# EAGLE schematic bubbler (EAGLE 6.4)

## Sheet 1 of 4
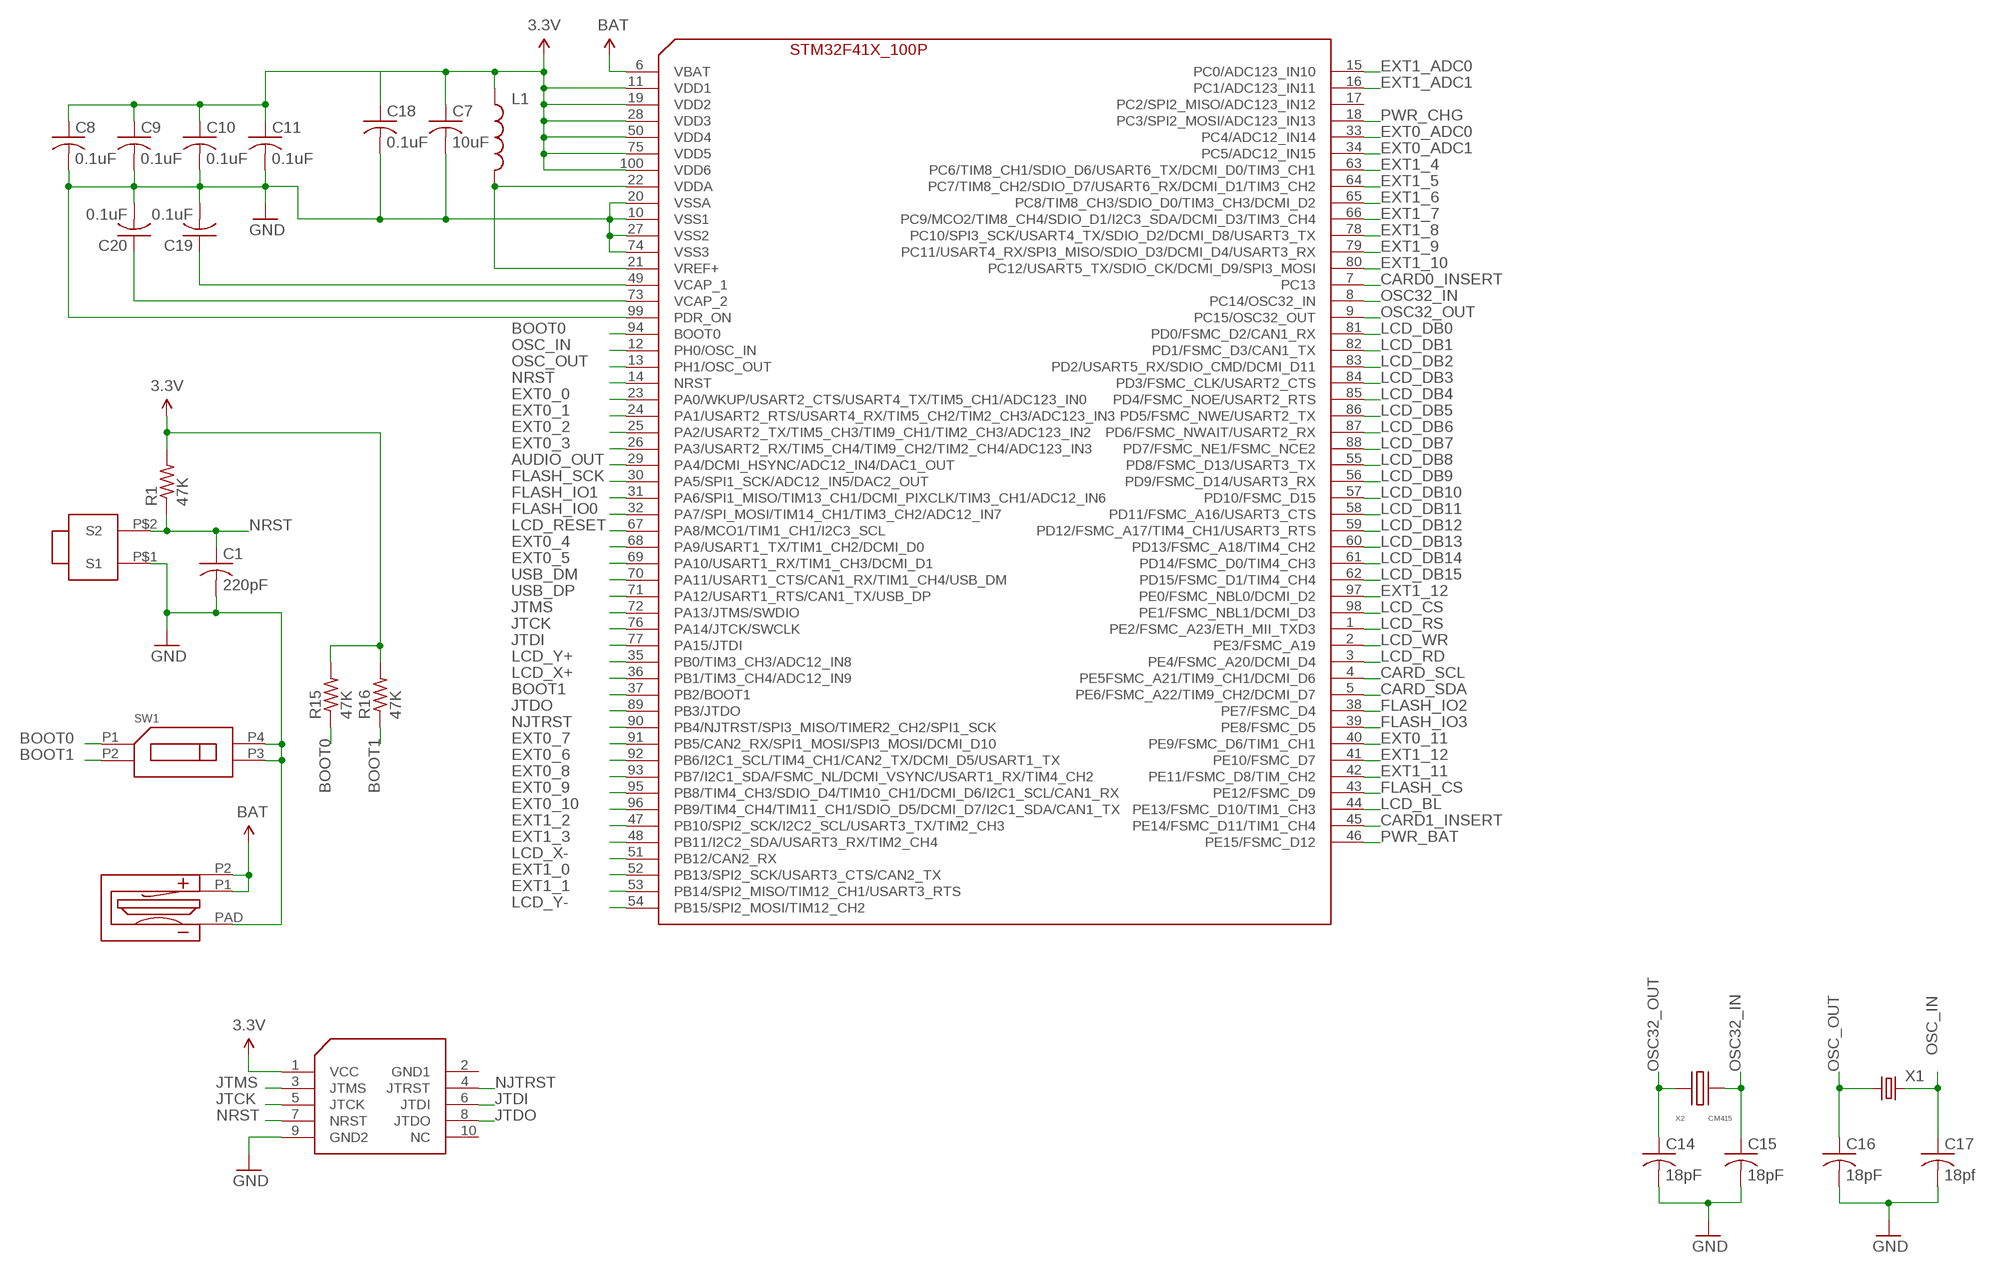
[diagram p0: schematic, sheet 1]

### Parts
B1  BATTERY-LINX-HLD-001  [BATTERY-LINX-HLD-001]
C1  220pF  C-USC0402  [C0402]
C7  10uF  C-USC0805  [C0805]
C8  0.1uF  C-USC0402  [C0402]
C9  0.1uF  C-USC0402  [C0402]
C10  0.1uF  C-USC0402  [C0402]
C11  0.1uF  C-USC0402  [C0402]
C14  18pF  C-USC0402  [C0402]
C15  18pF  C-USC0402  [C0402]
C16  18pF  C-USC0402  [C0402]
C17  18pf  C-USC0402  [C0402]
C18  0.1uF  C-USC0402  [C0402]
C19  0.1uF  C-USC0402  [C0402]
C20  0.1uF  C-USC0402  [C0402]
L1  INDUCTOR0603  [0603]
R1  47K  R-US_R0402  [R0402]
R15  47K  R-US_R0402  [R0402]
R16  47K  R-US_R0402  [R0402]
SW1  SWITCH-DIP-GDH-02  [SWITCH-DIP-GDH-02]
SW2  ITT-SWITCH-KSS-G  [ITT-KSS-G]
U1  STM32F41X-100P  [TQFP100]
U$1  STM32-JTAG-10P  [STM32-JTAG-10P]
X1  CRYSTAL5X3  [CRYSTAL-SMD-5X3]
X2  CM415  [CM415]

### Nets
3.3V: C7.1 C8.1 C9.1 C10.1 C11.1 C18.1 L1.1 R1.2 R15.2 R16.2 U1.11(VDD1) U1.19(VDD2) U1.28(VDD3) U1.50(VDD4) U1.75(VDD5) U1.100(VDD6) U$1.1(VCC) ; supply symbol labelled @3.3V ; also sheet 2,3,4
AUDIO_OUT: U1.29(PA4/DCMI_HSYNC/ADC12_IN4/DAC1_OUT) ; also sheet 4
BAT: B1.P1(BAT1) B1.P2(BAT2) U1.6(VBAT) ; supply symbol labelled @BAT
BOOT0: R15.1 SW1.P1(SW0_0) U1.94(BOOT0)
BOOT1: R16.1 SW1.P2(SW1_0) U1.37(PB2/BOOT1)
CARD0_INSERT: U1.7(PC13) ; also sheet 2
CARD1_INSERT: U1.45(PE14/FSMC_D11/TIM1_CH4) ; also sheet 2
CARD_SCL: U1.4(PE5FSMC_A21/TIM9_CH1/DCMI_D6) ; also sheet 2
CARD_SDA: U1.5(PE6/FSMC_A22/TIM9_CH2/DCMI_D7) ; also sheet 2
EXT0_0: U1.23(PA0/WKUP/USART2_CTS/USART4_TX/TIM5_CH1/ADC123_IN0) ; also sheet 2
EXT0_1: U1.24(PA1/USART2_RTS/USART4_RX/TIM5_CH2/TIM2_CH3/ADC123_IN3) ; also sheet 2
EXT0_2: U1.25(PA2/USART2_TX/TIM5_CH3/TIM9_CH1/TIM2_CH3/ADC123_IN2) ; also sheet 2
EXT0_3: U1.26(PA3/USART2_RX/TIM5_CH4/TIM9_CH2/TIM2_CH4/ADC123_IN3) ; also sheet 2
EXT0_4: U1.68(PA9/USART1_TX/TIM1_CH2/DCMI_D0) ; also sheet 2
EXT0_5: U1.69(PA10/USART1_RX/TIM1_CH3/DCMI_D1) ; also sheet 2
EXT0_6: U1.92(PB6/I2C1_SCL/TIM4_CH1/CAN2_TX/DCMI_D5/USART1_TX) ; also sheet 2
EXT0_7: U1.91(PB5/CAN2_RX/SPI1_MOSI/SPI3_MOSI/DCMI_D10) ; also sheet 2
EXT0_8: U1.93(PB7/I2C1_SDA/FSMC_NL/DCMI_VSYNC/USART1_RX/TIM4_CH2) ; also sheet 2
EXT0_9: U1.95(PB8/TIM4_CH3/SDIO_D4/TIM10_CH1/DCMI_D6/I2C1_SCL/CAN1_RX) ; also sheet 2
EXT0_10: U1.96(PB9/TIM4_CH4/TIM11_CH1/SDIO_D5/DCMI_D7/I2C1_SDA/CAN1_TX) ; also sheet 2
EXT0_11: U1.40(PE9/FSMC_D6/TIM1_CH1) ; also sheet 2
EXT0_ADC0: U1.33(PC4/ADC12_IN14) ; also sheet 2
EXT0_ADC1: U1.34(PC5/ADC12_IN15) ; also sheet 2
EXT1_0: U1.52(PB13/SPI2_SCK/USART3_CTS/CAN2_TX) ; also sheet 2
EXT1_1: U1.53(PB14/SPI2_MISO/TIM12_CH1/USART3_RTS) ; also sheet 2
EXT1_2: U1.47(PB10/SPI2_SCK/I2C2_SCL/USART3_TX/TIM2_CH3) ; also sheet 2
EXT1_3: U1.48(PB11/I2C2_SDA/USART3_RX/TIM2_CH4) ; also sheet 2
EXT1_4: U1.63(PC6/TIM8_CH1/SDIO_D6/USART6_TX/DCMI_D0/TIM3_CH1) ; also sheet 2
EXT1_5: U1.64(PC7/TIM8_CH2/SDIO_D7/USART6_RX/DCMI_D1/TIM3_CH2) ; also sheet 2
EXT1_6: U1.65(PC8/TIM8_CH3/SDIO_D0/TIM3_CH3/DCMI_D2) ; also sheet 2
EXT1_7: U1.66(PC9/MCO2/TIM8_CH4/SDIO_D1/I2C3_SDA/DCMI_D3/TIM3_CH4) ; also sheet 2
EXT1_8: U1.78(PC10/SPI3_SCK/USART4_TX/SDIO_D2/DCMI_D8/USART3_TX) ; also sheet 2
EXT1_9: U1.79(PC11/USART4_RX/SPI3_MISO/SDIO_D3/DCMI_D4/USART3_RX) ; also sheet 2
EXT1_10: U1.80(PC12/USART5_TX/SDIO_CK/DCMI_D9/SPI3_MOSI) ; also sheet 2
EXT1_11: U1.42(PE11/FSMC_D8/TIM_CH2) ; also sheet 2
EXT1_12: U1.41(PE10/FSMC_D7) U1.97(PE0/FSMC_NBL0/DCMI_D2) ; also sheet 2
EXT1_ADC0: U1.15(PC0/ADC123_IN10) ; also sheet 2
EXT1_ADC1: U1.16(PC1/ADC123_IN11) ; also sheet 2
FLASH_CS: U1.43(PE12/FSMC_D9) ; also sheet 4
FLASH_IO0: U1.32(PA7/SPI_MOSI/TIM14_CH1/TIM3_CH2/ADC12_IN7) ; also sheet 4
FLASH_IO1: U1.31(PA6/SPI1_MISO/TIM13_CH1/DCMI_PIXCLK/TIM3_CH1/ADC12_IN6) ; also sheet 4
FLASH_IO2: U1.38(PE7/FSMC_D4) ; also sheet 4
FLASH_IO3: U1.39(PE8/FSMC_D5) ; also sheet 4
FLASH_SCK: U1.30(PA5/SPI1_SCK/ADC12_IN5/DAC2_OUT) ; also sheet 4
GND: B1.PAD(GND) C1.2 C7.2 C8.2 C9.2 C10.2 C11.2 C14.2 C15.2 C16.2 C17.2 C18.2 C19.2 C20.2 SW1.P3(SW1_1) SW1.P4(SW0_1) SW2.P$1(S1) U1.10(VSS1) U1.20(VSSA) U1.27(VSS2) U1.74(VSS3) U1.99(PDR_ON) U$1.9(GND2) ; also sheet 2,3,4
JTCK: U1.76(PA14/JTCK/SWCLK) U$1.5(JTCK)
JTDI: U1.77(PA15/JTDI) U$1.6(JTDI)
JTDO: U1.89(PB3/JTDO) U$1.8(JTDO)
JTMS: U1.72(PA13/JTMS/SWDIO) U$1.3(JTMS)
LCD_BL: U1.44(PE13/FSMC_D10/TIM1_CH3) ; also sheet 3
LCD_CS: U1.98(PE1/FSMC_NBL1/DCMI_D3) ; also sheet 3
LCD_DB0: U1.81(PD0/FSMC_D2/CAN1_RX) ; also sheet 3
LCD_DB1: U1.82(PD1/FSMC_D3/CAN1_TX) ; also sheet 3
LCD_DB2: U1.83(PD2/USART5_RX/SDIO_CMD/DCMI_D11) ; also sheet 3
LCD_DB3: U1.84(PD3/FSMC_CLK/USART2_CTS) ; also sheet 3
LCD_DB4: U1.85(PD4/FSMC_NOE/USART2_RTS) ; also sheet 3
LCD_DB5: U1.86(PD5/FSMC_NWE/USART2_TX) ; also sheet 3
LCD_DB6: U1.87(PD6/FSMC_NWAIT/USART2_RX) ; also sheet 3
LCD_DB7: U1.88(PD7/FSMC_NE1/FSMC_NCE2) ; also sheet 3
LCD_DB8: U1.55(PD8/FSMC_D13/USART3_TX) ; also sheet 3
LCD_DB9: U1.56(PD9/FSMC_D14/USART3_RX) ; also sheet 3
LCD_DB10: U1.57(PD10/FSMC_D15) ; also sheet 3
LCD_DB11: U1.58(PD11/FSMC_A16/USART3_CTS) ; also sheet 3
LCD_DB12: U1.59(PD12/FSMC_A17/TIM4_CH1/USART3_RTS) ; also sheet 3
LCD_DB13: U1.60(PD13/FSMC_A18/TIM4_CH2) ; also sheet 3
LCD_DB14: U1.61(PD14/FSMC_D0/TIM4_CH3) ; also sheet 3
LCD_DB15: U1.62(PD15/FSMC_D1/TIM4_CH4) ; also sheet 3
LCD_RD: U1.3(PE4/FSMC_A20/DCMI_D4) ; also sheet 3
LCD_RESET: U1.67(PA8/MCO1/TIM1_CH1/I2C3_SCL) ; also sheet 3
LCD_RS: U1.1(PE2/FSMC_A23/ETH_MII_TXD3) ; also sheet 3
LCD_WR: U1.2(PE3/FSMC_A19) ; also sheet 3
LCD_X+: U1.36(PB1/TIM3_CH4/ADC12_IN9) ; also sheet 3
LCD_X-: U1.51(PB12/CAN2_RX) ; also sheet 3
LCD_Y+: U1.35(PB0/TIM3_CH3/ADC12_IN8) ; also sheet 3
LCD_Y-: U1.54(PB15/SPI2_MOSI/TIM12_CH2) ; also sheet 3
N$11: L1.2 U1.21(VREF+) U1.22(VDDA)
N$12: C19.1 U1.49(VCAP_1)
N$14: C20.1 U1.73(VCAP_2)
NJTRST: U1.90(PB4/NJTRST/SPI3_MISO/TIMER2_CH2/SPI1_SCK) U$1.4(JTRST)
NRST: C1.1 R1.1 SW2.P$2(S2) U1.14(NRST) U$1.7(NRST)
OSC32_IN: C15.1 U1.8(PC14/OSC32_IN) X2.P$2(XOUT)
OSC32_OUT: C14.1 U1.9(PC15/OSC32_OUT) X2.P$1(XIN)
OSC_IN: C17.1 U1.12(PH0/OSC_IN) X1.3
OSC_OUT: C16.1 U1.13(PH1/OSC_OUT) X1.1
PWR_BAT: U1.46(PE15/FSMC_D12) ; also sheet 2
PWR_CHG: U1.18(PC3/SPI2_MOSI/ADC123_IN13) ; also sheet 2
USB_DM: U1.70(PA11/USART1_CTS/CAN1_RX/TIM1_CH4/USB_DM) ; also sheet 2
USB_DP: U1.71(PA12/USART1_RTS/CAN1_TX/USB_DP) ; also sheet 2
Unconnected: U1.17(PC2/SPI2_MISO/ADC123_IN12) U$1.2(GND1) U$1.10(NC)

## Sheet 2 of 4
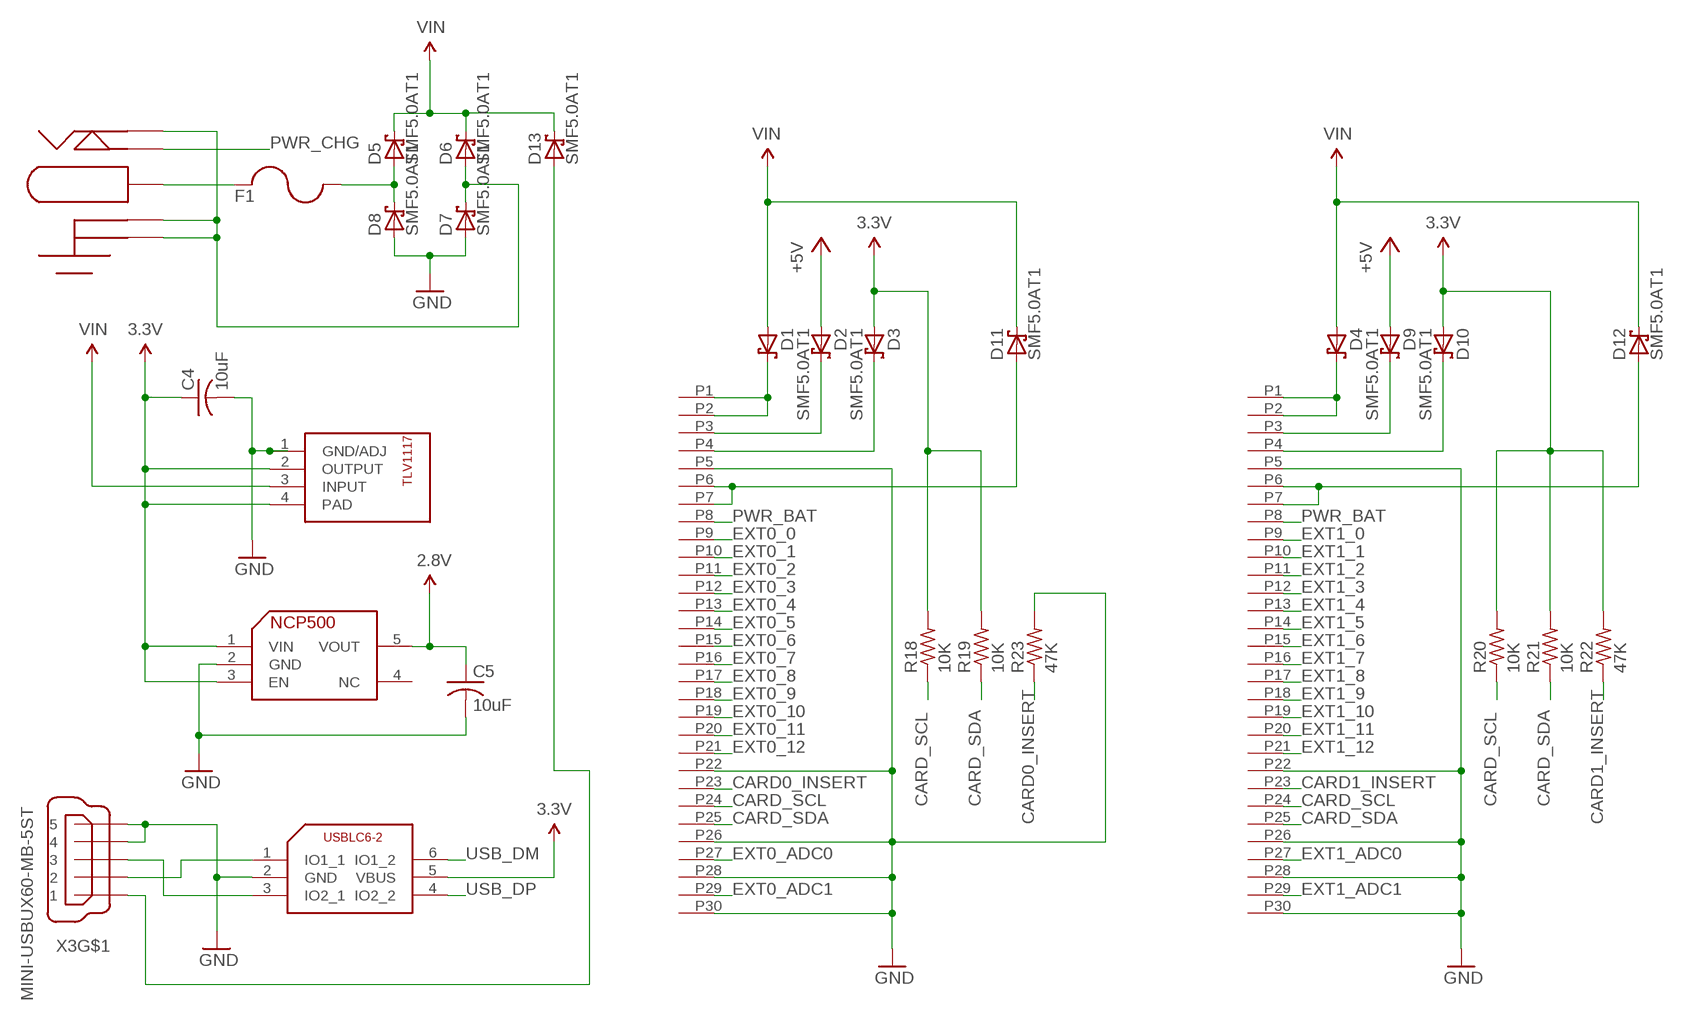
[diagram p1: schematic, sheet 2]

### Parts
C4  10uF  C-USC1206  [C1206]
C5  10uF  C-USC1206  [C1206]
CARD0  CONNECTOR-JAE-TX24-30F  [CONNECTOR-JAE-TX24-30]
CARD1  CONNECTOR-JAE-TX24-30F  [CONNECTOR-JAE-TX24-30]
D1  SCHOTTKY-DIODESMD  [SMB]
D2  SMF5.0AT1  [SOD123FL]
D3  SMF5.0AT1  [SOD123FL]
D4  SCHOTTKY-DIODESMD  [SMB]
D5  SMF5.0AT1  [SOD123FL]
D6  SMF5.0AT1  [SOD123FL]
D7  SMF5.0AT1  [SOD123FL]
D8  SMF5.0AT1  [SOD123FL]
D9  SMF5.0AT1  [SOD123FL]
D10  SMF5.0AT1  [SOD123FL]
D11  SMF5.0AT1  [SOD123FL]
D12  SMF5.0AT1  [SOD123FL]
D13  SMF5.0AT1  [SOD123FL]
F1  BOURNES-PTC-MF-SMXXXMF-SM030  [MF-SM030]
R18  10K  R-US_R0402  [R0402]
R19  10K  R-US_R0402  [R0402]
R20  10K  R-US_R0402  [R0402]
R21  10K  R-US_R0402  [R0402]
R22  47K  R-US_R0402  [R0402]
R23  47K  R-US_R0402  [R0402]
U5  USBLC6-2  [SOT23-6L]
U6  TLV1117  [SOT223]
U$2  DCJACK-CUI-PJ051AH  [DCJACK_CUI_PJ012B]
U$7  NCP500  [SOT23-5L]
X3  MINI-USBUX60-MB-5ST  [DUBLIB_UX60-MB-5ST]

### Nets
2.8V: C5.1 U$7.5(VOUT) ; supply symbol labelled @2.8V ; also sheet 3
3.3V: C4.1 D3.A D10.A R18.2 R19.2 R20.2 R21.2 R22.2 U5.5(VBUS) U6.2(OUTPUT) U6.4(PAD) U$7.1(VIN) U$7.3(EN) ; supply symbol labelled @3.3V ; also sheet 1,3,4
+5V: D2.A D9.A
CARD0_INSERT: CARD0.P23 R23.1 ; also sheet 1
CARD1_INSERT: CARD1.P23 R22.1 ; also sheet 1
CARD_SCL: CARD0.P24 CARD1.P24 R18.1 R20.1 ; also sheet 1
CARD_SDA: CARD0.P25 CARD1.P25 R19.1 R21.1 ; also sheet 1
EXT0_0: CARD0.P9 ; also sheet 1
EXT0_1: CARD0.P10 ; also sheet 1
EXT0_2: CARD0.P11 ; also sheet 1
EXT0_3: CARD0.P12 ; also sheet 1
EXT0_4: CARD0.P13 ; also sheet 1
EXT0_5: CARD0.P14 ; also sheet 1
EXT0_6: CARD0.P15 ; also sheet 1
EXT0_7: CARD0.P16 ; also sheet 1
EXT0_8: CARD0.P17 ; also sheet 1
EXT0_9: CARD0.P18 ; also sheet 1
EXT0_10: CARD0.P19 ; also sheet 1
EXT0_11: CARD0.P20 ; also sheet 1
EXT0_12: CARD0.P21
EXT0_ADC0: CARD0.P27 ; also sheet 1
EXT0_ADC1: CARD0.P29 ; also sheet 1
EXT1_0: CARD1.P9 ; also sheet 1
EXT1_1: CARD1.P10 ; also sheet 1
EXT1_2: CARD1.P11 ; also sheet 1
EXT1_3: CARD1.P12 ; also sheet 1
EXT1_4: CARD1.P13 ; also sheet 1
EXT1_5: CARD1.P14 ; also sheet 1
EXT1_6: CARD1.P15 ; also sheet 1
EXT1_7: CARD1.P16 ; also sheet 1
EXT1_8: CARD1.P17 ; also sheet 1
EXT1_9: CARD1.P18 ; also sheet 1
EXT1_10: CARD1.P19 ; also sheet 1
EXT1_11: CARD1.P20 ; also sheet 1
EXT1_12: CARD1.P21 ; also sheet 1
EXT1_ADC0: CARD1.P27 ; also sheet 1
EXT1_ADC1: CARD1.P29 ; also sheet 1
GND: C4.2 C5.2 CARD0.P5 CARD0.P22 CARD0.P26 CARD0.P28 CARD0.P30 CARD1.P5 CARD1.P22 CARD1.P26 CARD1.P28 CARD1.P30 D7.A D8.A R23.2 U5.2(GND) U6.1(GND/ADJ) U$7.2(GND) X3.4 X3.5 ; supply symbol labelled @GND ; also sheet 1,3,4
N$1: CARD1.P4 D10.C
N$2: D6.A D7.C U$2.GND1 U$2.GND2 U$2.P2
N$3: F1.P$1 U$2.P1
N$5: U5.1(IO1_1) X3.2
N$6: U5.3(IO2_1) X3.3
N$7: D5.A D8.C F1.P$2
N$9: CARD0.P4 D3.C
N$15: CARD0.P1 CARD0.P2 D1.C
N$21: CARD1.P1 CARD1.P2 D4.C
N$22: CARD0.P3 D2.C
N$24: CARD0.P6 CARD0.P7 D11.A
N$25: CARD1.P3 D9.C
N$26: D13.A X3.1
N$28: CARD1.P6 CARD1.P7 D12.A
PWR_BAT: CARD0.P8 CARD1.P8 ; also sheet 1
PWR_CHG: U$2.P3 ; also sheet 1
USB_DM: U5.6(IO1_2) ; also sheet 1
USB_DP: U5.4(IO2_2) ; also sheet 1
VIN: D1.A D4.A D5.C D6.C D11.C D12.C D13.C U6.3(INPUT) ; supply symbol labelled @VIN
Unconnected: U$7.4(NC)

## Sheet 3 of 4
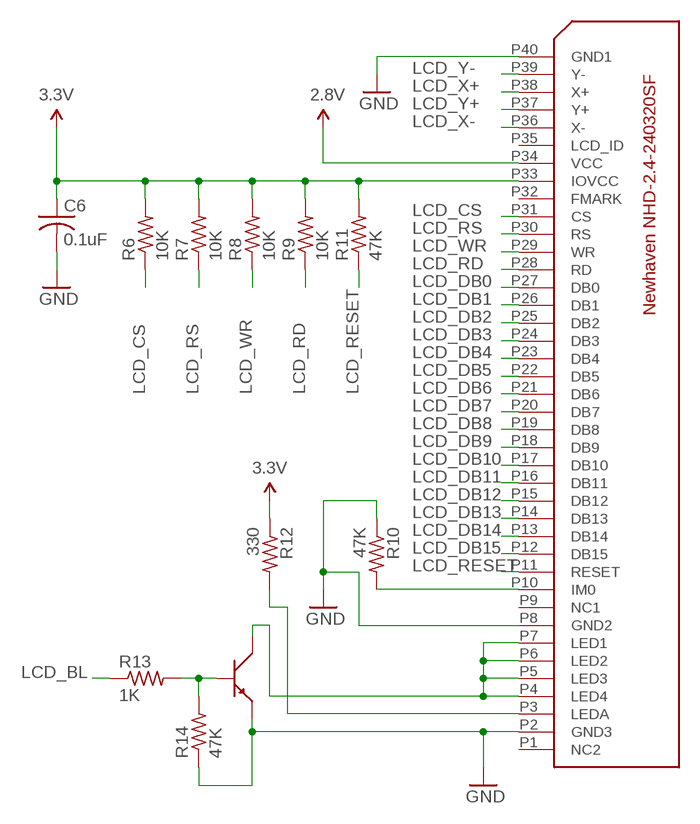
[diagram p2: schematic, sheet 3]

### Parts
C6  0.1uF  C-USC0402  [C0402]
R6  10K  R-US_R0402  [R0402]
R7  10K  R-US_R0402  [R0402]
R8  10K  R-US_R0402  [R0402]
R9  10K  R-US_R0402  [R0402]
R10  47K  R-US_R0402  [R0402]
R11  47K  R-US_R0402  [R0402]
R12  330  R-US_R1206  [R1206]
R13  1K  R-US_R0402  [R0402]
R14  47K  R-US_R0402  [R0402]
U4  BIPOLAR-PMBT6428  [DUBLIB_SOT23]
U$10  NHD-2.4-240320SF  [MOLEX-534132-060]

### Nets
2.8V: U$10.P34(VCC) ; supply symbol labelled @2.8V ; also sheet 2
3.3V: C6.1 R6.2 R7.2 R8.2 R9.2 R11.2 R12.1 U$10.P33(IOVCC) ; supply symbol labelled @3.3V ; also sheet 1,2,4
GND: C6.2 R10.1 R14.1 U4.2 U$10.P2(GND3) U$10.P8(GND2) U$10.P40(GND1) ; supply symbol labelled @GND ; also sheet 1,2,4
LCD_BL: R13.1 ; also sheet 1
LCD_CS: R6.1 U$10.P31(CS) ; also sheet 1
LCD_DB0: U$10.P27(DB0) ; also sheet 1
LCD_DB1: U$10.P26(DB1) ; also sheet 1
LCD_DB2: U$10.P25(DB2) ; also sheet 1
LCD_DB3: U$10.P24(DB3) ; also sheet 1
LCD_DB4: U$10.P23(DB4) ; also sheet 1
LCD_DB5: U$10.P22(DB5) ; also sheet 1
LCD_DB6: U$10.P21(DB6) ; also sheet 1
LCD_DB7: U$10.P20(DB7) ; also sheet 1
LCD_DB8: U$10.P19(DB8) ; also sheet 1
LCD_DB9: U$10.P18(DB9) ; also sheet 1
LCD_DB10: U$10.P17(DB10) ; also sheet 1
LCD_DB11: U$10.P16(DB11) ; also sheet 1
LCD_DB12: U$10.P15(DB12) ; also sheet 1
LCD_DB13: U$10.P14(DB13) ; also sheet 1
LCD_DB14: U$10.P13(DB14) ; also sheet 1
LCD_DB15: U$10.P12(DB15) ; also sheet 1
LCD_RD: R9.1 U$10.P28(RD) ; also sheet 1
LCD_RESET: R11.1 U$10.P11(RESET) ; also sheet 1
LCD_RS: R7.1 U$10.P30(RS) ; also sheet 1
LCD_WR: R8.1 U$10.P29(WR) ; also sheet 1
LCD_X+: U$10.P38(X+) ; also sheet 1
LCD_X-: U$10.P36(X-) ; also sheet 1
LCD_Y+: U$10.P37(Y+) ; also sheet 1
LCD_Y-: U$10.P39(Y-) ; also sheet 1
N$4: R10.2 U$10.P10(IM0)
N$8: R12.2 U$10.P3(LEDA)
N$10: U4.3 U$10.P4(LED4) U$10.P5(LED3) U$10.P6(LED2) U$10.P7(LED1)
N$13: R13.2 R14.2 U4.1
Unconnected: U$10.P1(NC2) U$10.P9(NC1) U$10.P32(FMARK) U$10.P35(LCD_ID)

## Sheet 4 of 4
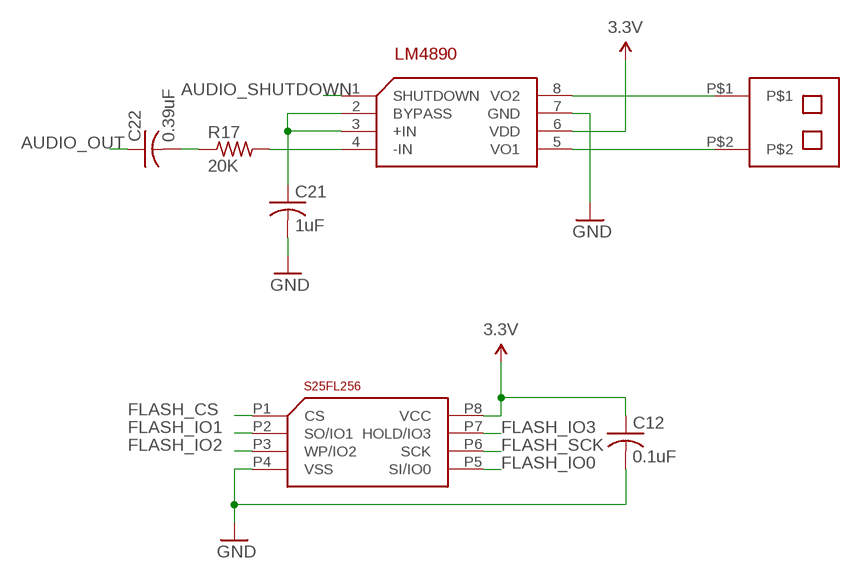
[diagram p3: schematic, sheet 4]

### Parts
C12  0.1uF  C-USC0402  [C0402]
C21  1uF  C-USC0402  [C0402]
C22  0.39uF  C-USC0402  [C0402]
R17  20K  R-US_R0402  [R0402]
U2  SPANSION-S25FL256  [SPANSION-WSON-8]
U3  LM4890  [TSSOP8]
U7  MOLEX-1.25-WTB-RA-CONN-2POS  [MOLEX-1.25WTB-RA-CONN]

### Nets
3.3V: C12.1 U2.P8(VCC) U3.6(VDD) ; supply symbol labelled @3.3V ; also sheet 1,2,3
AUDIO_OUT: C22.1 ; also sheet 1
AUDIO_SHUTDOWN: U3.1(SHUTDOWN)
FLASH_CS: U2.P1(CS) ; also sheet 1
FLASH_IO0: U2.P5(SI/IO0) ; also sheet 1
FLASH_IO1: U2.P2(SO/IO1) ; also sheet 1
FLASH_IO2: U2.P3(WP/IO2) ; also sheet 1
FLASH_IO3: U2.P7(HOLD/IO3) ; also sheet 1
FLASH_SCK: U2.P6(SCK) ; also sheet 1
GND: C12.2 C21.2 U2.P4(VSS) U3.7(GND) ; supply symbol labelled @GND ; also sheet 1,2,3
N$16: U3.5(VO1) U7.P$2
N$17: U3.8(VO2) U7.P$1
N$18: C21.1 U3.2(BYPASS) U3.3(+IN)
N$19: R17.2 U3.4(-IN)
N$20: C22.2 R17.1

## Power pins joined to a net without a drawn wire
GND: U7.P$3(GND) U7.P$4(GND) X3.M1(GND) X3.M2(GND) X3.M3(GND) X3.M4(GND)

## Library data of the parts
B1 = Pygmy:BATTERY-LINX-HLD-001
C1 C4-C12 C14-C22 = rcl:C-US: CAPACITOR, American symbol
CARD0 CARD1 = Pygmy:CONNECTOR-JAE-TX24-30F
D1 D4 = diode:SCHOTTKY-DIODE: Schottky Diode
D2 D3 D5-D13 = diode:SMF5.0AT1: 200 W Transient Voltage Suppressor Source: Data sheet <http://www.onsemi.com/pub_link/Collateral/SMF5.0AT1-D.PDF>
F1 = Pygmy:BOURNES-PTC-MF-SMXXX
L1 = SparkFun-Passives:INDUCTOR: Inductors Basic Inductor/Choke - 0603 and 1206. Footprints are not proven and vary greatly between part numbers.
R1 R6-R23 = rcl:R-US_: RESISTOR, American symbol
SW1 = Pygmy:SWITCH-DIP-GDH-02
SW2 = Pygmy:ITT-SWITCH-KSS-G
U1 = Pygmy:STM32F41X-100P
U2 = Pygmy:SPANSION-S25FL256
U3 = Pygmy:LM4890
U4 = Pygmy:BIPOLAR-PMBT6428
U5 = Pygmy:USBLC6-2
U6 = Pygmy:TLV1117
U7 = Pygmy:MOLEX-1.25-WTB-RA-CONN-2POS
U$1 = Pygmy:STM32-JTAG-10P
U$2 = Pygmy:DCJACK-CUI-PJ051AH
U$7 = Pygmy:NCP500
U$10 = Pygmy:NHD-2.4-240320SF
X1 = SparkFun-FreqCtrl:CRYSTAL: Various standard crystals. Proven footprints. Spark Fun Electronics SKU : COM-00534
X2 = Pygmy:CM415
X3 = Pygmy:MINI-USB: MINI USB Connector Source: http://www.hirose.co.jp/cataloge_hp/e24000019.pdf